# EAGLE design Ctrl_Btnrgb_brd (EAGLE 9.1.3)
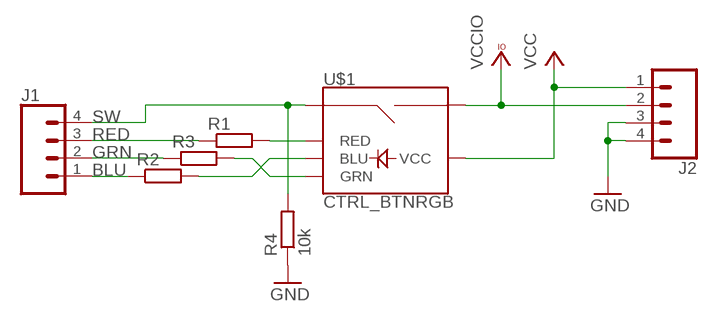
[diagram p0: schematic, sheet 1]

## Parts
J1  CONN_04  [1X04]
J2  CONN_04  [1X04]
R1  R-EU_R0603  [R0603]
R2  R-EU_R0603  [R0603]
R3  R-EU_R0603  [R0603]
R4  10k  R-EU_R0603  [R0603]
U$1  CTRL_BTNRGB  [CTRL_BTNRGB]

## Nets
BLU: J1.1 R2.1
GND: J2.3 J2.4 R4.1
GRN: J1.2 R3.1
N$1: R1.2 U$1.RED
N$2: R2.2 U$1.BLU
N$3: R3.2 U$1.GRN
RED: J1.3 R1.1
SW: J1.4 R4.2 U$1.SIG1
VCC: J2.1 U$1.VCC
VCCIO: J2.2 U$1.SIG2

## Library data of the parts
J1 J2 = SparkFun-Connectors:CONN_04: Multi connection point. Often used as Generic Header-pin footprint for 0.1 inch spaced/style header connections On any of the 0.1 inch spaced packages, you can populate with these: Break Away Headers - Straight <https://www.sparkfun.com/products/116> (PRT-00116) Break Away Male Headers - Right Angle <https://www.sparkfun.com/products/553> (PRT-00553) Female Headers <https://www.sparkfun.com/products/115> (PRT-00115) Break Away Headers - Machine Pin <https://www.sparkfun.com/products/117> (PRT-00117) Break Away Female Headers - Swiss Machine Pin <https://www.sparkfun.com/products/743> (PRT-00743) For SCREWTERMINALS and SPRING TERMINALS visit here: Screw Terimnals on SparkFun.com <https://www.sparkfun.com/search/results?term=Screw+Terminals> (5mm/3.5mm/2.54mm spacing) This device is also useful as a general connection point to wire up your design to another part of your project. Our various solder wires solder well into these plated through hole pads. Hook-Up Wire - Assortment (Stranded, 22 AWG) <https://www.sparkfun.com/products/11375> (PRT-11375) Hook-Up Wire - Assortment (Solid Core, 22 AWG) <https://www.sparkfun.com/products/11367> (PRT-11367) View the entire wire category on our website here <https://www.sparkfun.com/categories/141> Special notes: Molex polarized connector foot print use with SKU : PRT-08231 with associated crimp pins and housings. 1MM SMD Version SKU: PRT-10208; PROD_ID: CONN-09696
R1-R4 = resistor:R-EU_: RESISTOR, European symbol
U$1 = Ctrl:CTRL_BTNRGB

## Board
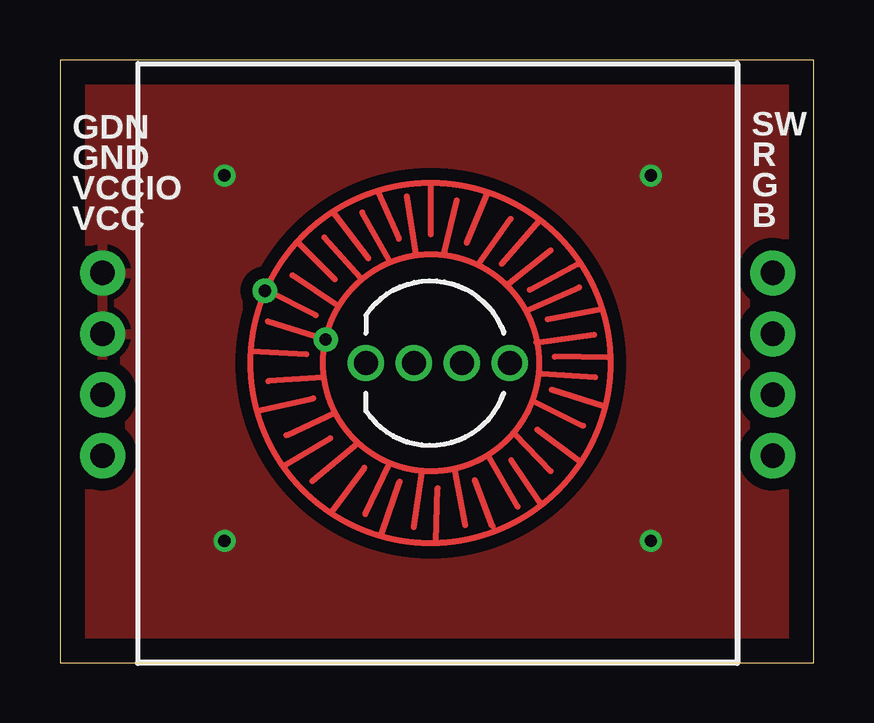
[diagram p1: board, top side]
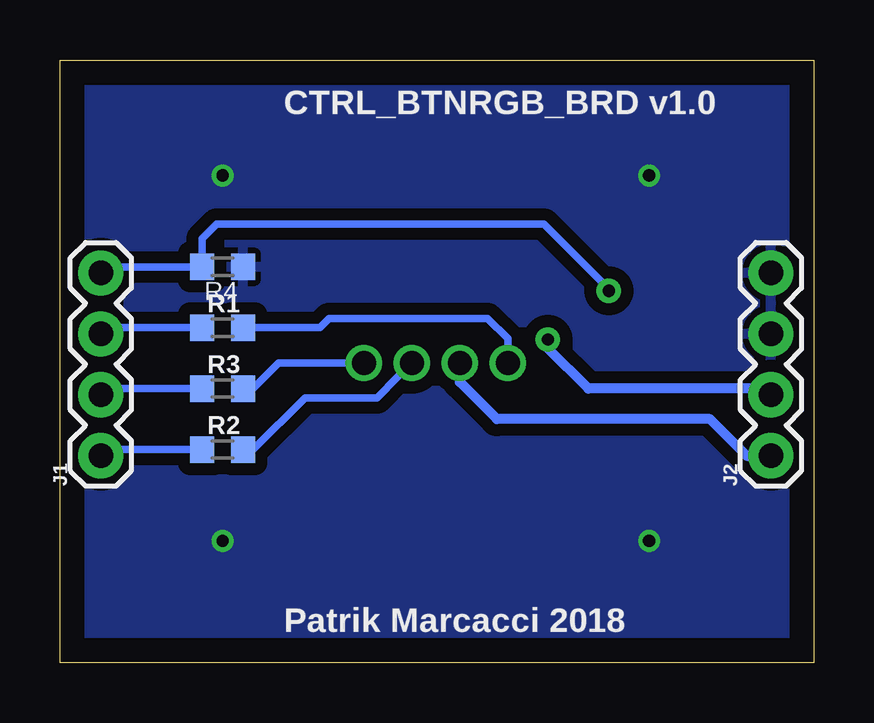
[diagram p2: board, bottom side, seen from below]

Size 31.42 x 25.14 mm. Coordinates in mm from the lower left corner, seen from the top.
Outline: 0,0 31.42,0 31.42,25.14 0,25.14 0,0
Copper layers (1*16): Top 0.035mm / dielectric 1.5mm / Bottom 0.035mm
Design rules "default *": minimum track width 6mil, minimum drill 0.35mm, track to track 20mil, track to pad 20mil, pad to pad 20mil, via to via 20mil, smd to smd 12mil, copper to edge 40mil, drill to drill 6mil, minimum pad ring 10mil, minimum via ring 8mil, stop-mask expansion 4mil, vias tented up to drill 20mil, thermal gap 10mil

### Footprints (pad centres in the part's own frame; a part is rotated, then mirrored left to right if it is on the bottom)
1X04 = drill 1.016 pad 1.88: 1 0,0; 2 2.54,0; 3 5.08,0; 4 7.62,0
R0603 = smd 1 x 1.1: 1 -0.85,0; 2 0.85,0
CTRL_BTNRGB = drill 1: BLU 13.5,12.5; GRN 15.5,12.5; RED 9.5,12.5; VCC 11.5,12.5 | drill 0.508: SIG1 5.288,15.513; SIG2 7.828,13.481

### Placement (x,y rotation side)
J1  29.72,8.64 90 bottom
J2  1.78,8.64 90 bottom
R1  24.64,13.97 0 bottom
R2  24.64,8.89 0 bottom
R3  24.64,11.43 0 bottom
R4  24.64,16.51 180 bottom
U$1  3.25,0 0 top

### Tracks (layer width: path | path; a pad name or v marks a point on that pad's centre or on a via)
BLU
  Bottom 0.305: R2.1 29.46,8.89 J1.1
GND  (via drill 0.51)
  other vias: 6.86,20.32 24.64,20.32 24.64,5.08 6.86,5.08
  pour Bottom: -0.76,25.4 32.26,25.4 32.26,0 -0.76,0
  pour Top: -0.76,25.4 -0.76,0 32.26,0 32.26,25.4
GRN
  Bottom 0.305: R3.1 29.46,11.43 J1.2
N$1
  Bottom 0.305: R1.2 20.57,13.97 20.19,14.35 13.59,14.35 12.75,13.51 U$1.RED
N$2
  Bottom 0.305: R2.2 23.37,8.89 21.21,11.05 18.2,11.05 17.34,11.91 | 17.34,11.91 | 17.34,11.91 U$1.BLU
N$3
  Bottom 0.305: U$1.GRN 22.3,12.5 23.37,11.43 R3.2
RED
  Bottom 0.305: R1.1 29.46,13.97 J1.3
SW
  Bottom 0.305: J1.4 29.46,16.51 27.18,16.51 R4.2 25.49,17.69 24.89,18.29 11.24,18.29 8.54,15.59 U$1.SIG1
VCC
  Bottom 0.406: J2.1 2.79,8.64 4.32,10.16 13.21,10.16 14.75,11.7 U$1.VCC
VCCIO
  Bottom 0.406: J2.2 2.03,11.43 9.4,11.43 11.08,13.11 U$1.SIG2

### Text on the board
tPlace: GDN | SW | GND | R | VCCIO | G | VCC | B
bPlace: CTRL_BTNRGB_BRD v1.0 | Patrik Marcacci 2018